# EAGLE schematic T02_noclock_rev4 (EAGLE 7.1.0)
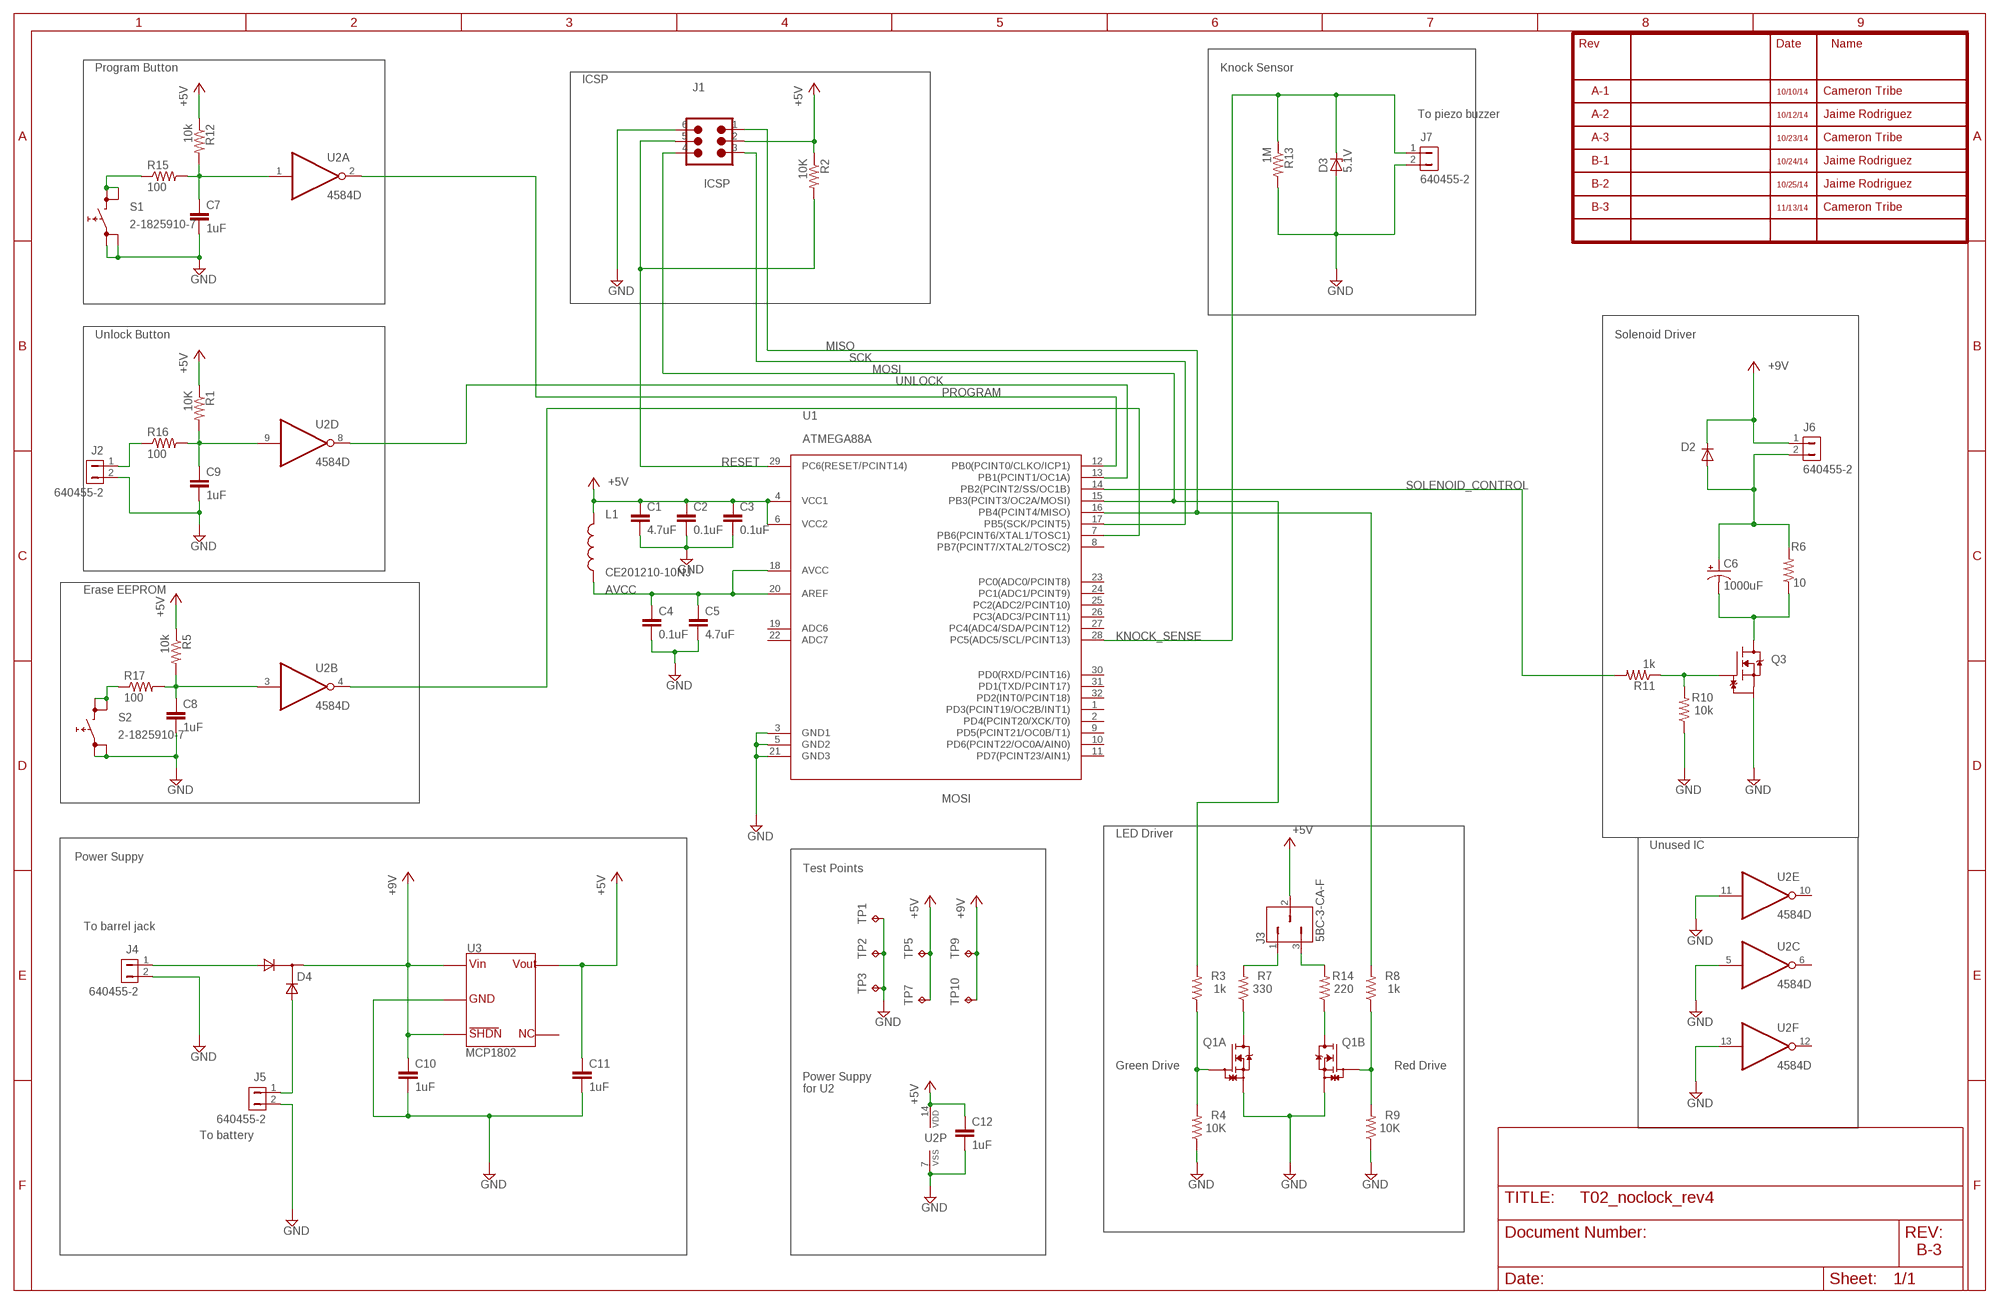
[diagram p0: schematic, sheet 1]

## Parts
C1  4.7uF  C-EUC0805  [C0805]
C2  0.1uF  C-EUC0805  [C0805]
C3  0.1uF  C-EUC0805  [C0805]
C4  0.1uF  C-EUC0805  [C0805]
C5  4.7uF  C-EUC0805  [C0805]
C6  1000uF  EKY-100ELL102MH20D  [EKY-100ELL102MH20D]
C7  1uF  C-EUC0805  [C0805]
C8  1uF  C-EUC0805  [C0805]
C9  1uF  C-EUC0805  [C0805]
C10  1uF  C-EUC0805  [C0805]
C11  1uF  C-EUC0805  [C0805]
C12  1uF  C-EUC0805  [C0805]
D2  GF1  [SMA-DO214AC]
D3  5.1V  ZENER-DIODESOT23  [SOT23]
D4  PMEG2005CT,215  [SOT-23]
J1  ICSP  [ICSP]
J2  640455-2  [2-PIN_CONNECTOR]
J3  5BC-3-CA-F  [3_PIN_CONNECTOR]
J4  640455-2  [2-PIN_CONNECTOR]
J5  640455-2  [2-PIN_CONNECTOR]
J6  640455-2  [2-PIN_CONNECTOR]
J7  640455-2  [2-PIN_CONNECTOR]
L1  CE201210-10NJ  [R0805]
Q1  DMN63D8LDW-7  [SOT363]
Q3  DMG1012UW-7  [SOT323]
R1  10K  R-US_R0805  [R0805]
R2  10K  R-US_R0805  [R0805]
R3  1k  R-US_R0805  [R0805]
R4  10K  R-US_R0805  [R0805]
R5  10k  R-US_R0805  [R0805]
R6  10  R-US_R2512  [R2512]
R7  330  R-US_R0805  [R0805]
R8  1k  R-US_R0805  [R0805]
R9  10K  R-US_R0805  [R0805]
R10  10k  R-US_R0805  [R0805]
R11  1k  R-US_R0805  [R0805]
R12  10k  R-US_R0805  [R0805]
R13  1M  R-US_R0805  [R0805]
R14  220  R-US_R0805  [R0805]
R15  100  R-US_R0805  [R0805]
R16  100  R-US_R0805  [R0805]
R17  100  R-US_R0805  [R0805]
S1  2-1825910-7  [FSM14JH]
S2  2-1825910-7  [FSM14JH]
TP1  TP  [TP100SQ]
TP2  TP  [TP100SQ]
TP3  TP  [TP100SQ]
TP5  TPTP19R  [TP19R]
TP7  TPTP19R  [TP19R]
TP9  TPTP19R  [TP19R]
TP10  TPTP19R  [TP19R]
U1  ATMEGA88A  [TQFP32]
U2  4584D  [SO14]
U3  MCP1802  [SOT23-5]

## Nets
9V: D4.3(A1) J4.1
+5V: C1.1 C2.1 C3.1 C11.1 C12.1 J1.2 J3.2 L1.2 R1.1 R2.1 R5.1 R12.1 TP5.TP TP7.TP U1.4(VCC1) U1.6(VCC2) U2.14(P:VDD) U3.5(VOUT)
+9V: C10.1 D2.K(C) D4.2(C) J6.1 TP9.TP TP10.TP U3.1(VIN) U3.3(SHDN)
AVCC: C4.1 C5.1 L1.1 U1.18(AVCC) U1.20(AREF)
BATT: D4.1(A2) J5.1
GND: C1.2 C2.2 C3.2 C4.2 C5.2 C7.2 C8.2 C9.2 C10.2 C11.2 C12.2 D3.1(A) J1.6 J2.2 J4.2 J5.2 J7.2 Q1.S1(A:S) Q1.S2(B:S) Q3.3(S) R4.1 R9.1 R10.1 R13.2 S1.1 S1.2 S2.1 S2.2 TP1.P$1(TP) TP2.P$1(TP) TP3.P$1(TP) U1.3(GND1) U1.5(GND2) U1.21(GND3) U2.7(P:VSS) U2.11(E:I) U2.13(F:I) U3.2(GND)
KNOCK_SENSE: D3.3(C) J7.1 R13.1 U1.28(PC5(ADC5/SCL/PCINT13))
MISO: J1.1 R8.2 U1.16(PB4(PCINT4/MISO))
MOSI: J1.4 R3.2 U1.15(PB3(PCINT3/OC2A/MOSI))
N$1: Q1.D1(A:D) R7.1
N$2: Q1.G2(B:G) R8.1 R9.2
N$3: C9.1 R1.2 R16.2 U2.9(D:I)
N$4: U1.7(PB6(PCINT6/XTAL1/TOSC1)) U2.4(B:O)
N$5: J3.1 R7.2
N$6: J3.3 R14.2
N$7: R15.1 S1.3 S1.4
N$8: Q1.D2(B:D) R14.1
N$9: Q3.2(G) R10.2 R11.1
N$10: C6.+ D2.A J6.2 R6.2
N$11: C6.- Q3.1(D) R6.1
N$14: R17.1 S2.3 S2.4
N$16: C8.1 R5.2 R17.2 U2.3(B:I)
N$17: J2.1 R16.1
N$19: C7.1 R12.2 R15.2 U2.1(A:I)
N$21: Q1.G1(A:G) R3.1 R4.2
PROGRAM: U1.12(PB0(PCINT0/CLKO/ICP1)) U2.2(A:O)
RESET: J1.5 R2.2 U1.29(PC6(RESET/PCINT14))
SCK: J1.3 U1.17(PB5(SCK/PCINT5))
SOLENOID_CONTROL: R11.2 U1.14(PB2(PCINT2/SS/OC1B))
UNLOCK: U1.13(PB1(PCINT1/OC1A)) U2.8(D:O)
Unconnected: U1.1(PD3(PCINT19/OC2B/INT1)) U1.2(PD4(PCINT20/XCK/T0)) U1.8(PB7(PCINT7/XTAL2/TOSC2)) U1.9(PD5(PCINT21/OC0B/T1)) U1.10(PD6(PCINT22/OC0A/AIN0)) U1.11(PD7(PCINT23/AIN1)) U1.19(ADC6) U1.22(ADC7) U1.23(PC0(ADC0/PCINT8)) U1.24(PC1(ADC1/PCINT9)) U1.25(PC2(ADC2/PCINT10)) U1.26(PC3(ADC3/PCINT11)) U1.27(PC4(ADC4/SDA/PCINT12)) U1.30(PD0(RXD/PCINT16)) U1.31(PD1(TXD/PCINT17)) U1.32(PD2(INT0/PCINT18)) U2.5(C:I) U2.6(C:O) U2.10(E:O) U2.12(F:O) U3.4(NC)

## Notes on the sheet
- Program Button | Knock Sensor
- ICSP
- A-1 | 10/10/14 | Cameron Tribe
- To piezo buzzer | A-2 | 10/12/14 | Jaime Rodriguez
- A-3 | 10/23/14 | Cameron Tribe
- B-1 | 10/24/14 | Jaime Rodriguez
- B-2 | 10/25/14 | Jaime Rodriguez
- B-3 | 11/13/14 | Cameron Tribe
- Unlock Button | Solenoid Driver
- Erase EEPROM
- LED Driver
- Unused IC
- Power Suppy
- Test Points
- To barrel jack
- Green Drive | Red Drive
- Power Suppy 
  for U2
- To battery
- B-3

## Library data of the parts
C1 C5 = rcl:C-EU: CAPACITOR, European symbol; PARTNUM: CL21A475KOFNNNE
C2-C4 = rcl:C-EU: CAPACITOR, European symbol; PARTNUM: GRM155R61A104KA01D
C6 = nocLock_temp:EKY-100ELL102MH20D: CAP ALUM 1000UF 10V 20% RADIAL
C7-C12 = rcl:C-EU: CAPACITOR, European symbol; PARTNUM: CL21B105KBFNNNE
D2 = diode:GF1: DIODE; PARTNUM: S1J
D3 = diode:ZENER-DIODE: Z-Diode; PARTNUM: BZX84C4V7-TP
D4 = nocLock_temp:PMEG2005CT,215; PARTNUM: PMEG2005CT,215
J1 = nocLock_temp:ICSP: Programming ICSP Header
J2 J4-J7 = T02_nocLock:640455-2: 2 Pin Rectangular Connector
J3 = T02_nocLock:5BC-3-CA-F: Connector Recept, 3-Pin
L1 = nocLock_temp:CE201210-10NJ: FIXED IND 10NH 300MA 300 MOHM
Q1 = nocLock_temp_Rev2:DMN63D8LDW-7: Dual MOSFET 2N-CH 30V 220MA SOT363; PARTNUM: DMN63D8LDW-7
Q3 = nocLock_temp:DMG1012UW-7: MOSFET N-CH 20V 1A SOT323 (For Solenoid); PARTNUM: DMG1012UW-7
R1 R2 R4 R5 R9 R10 R12 R15-R17 = rcl:R-US_: RESISTOR, American symbol; PARTNUM: ESR10EZPJ103
R3 R8 R11 = rcl:R-US_: RESISTOR, American symbol; PARTNUM: MCR10ERTF1001
R6 = rcl:R-US_: RESISTOR, American symbol; PARTNUM: CRM2512-JW-100ELF
R7 = rcl:R-US_: RESISTOR, American symbol; PARTNUM: MCR10ERTF3300
R13 = rcl:R-US_: RESISTOR, American symbol; PARTNUM: RMCF0805JT1M00
R14 = rcl:R-US_: RESISTOR, American symbol; PARTNUM: RMCF0805FT220R
S1 = nocLock_temp:2-1825910-7: SWITCH TACTILE SPST-NO 0.05A 12V Outline 6.00mm x 6.00mm Height 13mm
S2 = T02_nocLock:2-1825910-7: SWITCH TACTILE SPST-NO 0.05A 12V Outline 6.00mm x 6.00mm Height 13mm
TP1-TP3 TP5 TP7 TP9 TP10 = testpad:TP: Test pad
U1 = T02_nocLock:ATMEGA88A: ATMega88A 8-Bit Microcontroller 23 GPIO pins RISC Architecture Up to 20 MHz
U2 = 45xx:4584: Hex SCHMITT TRIGGER (74C14); PARTNUM: 4584D
U3 = nocLock_temp:MCP1802: 5V Voltage Regulator MCP1802 Input Voltage Range: 2.0- 10.0 V Output Voltage 5V Current Max: 300 mA 25 uA Quiescent Current; PARTNUM: MCP1802